# Altium schematic sheet FE_Channel.SchDoc: ThunderScope 1000E
size A3; DrawnBy: Aleksa Bjelogrlic; Revision: 1
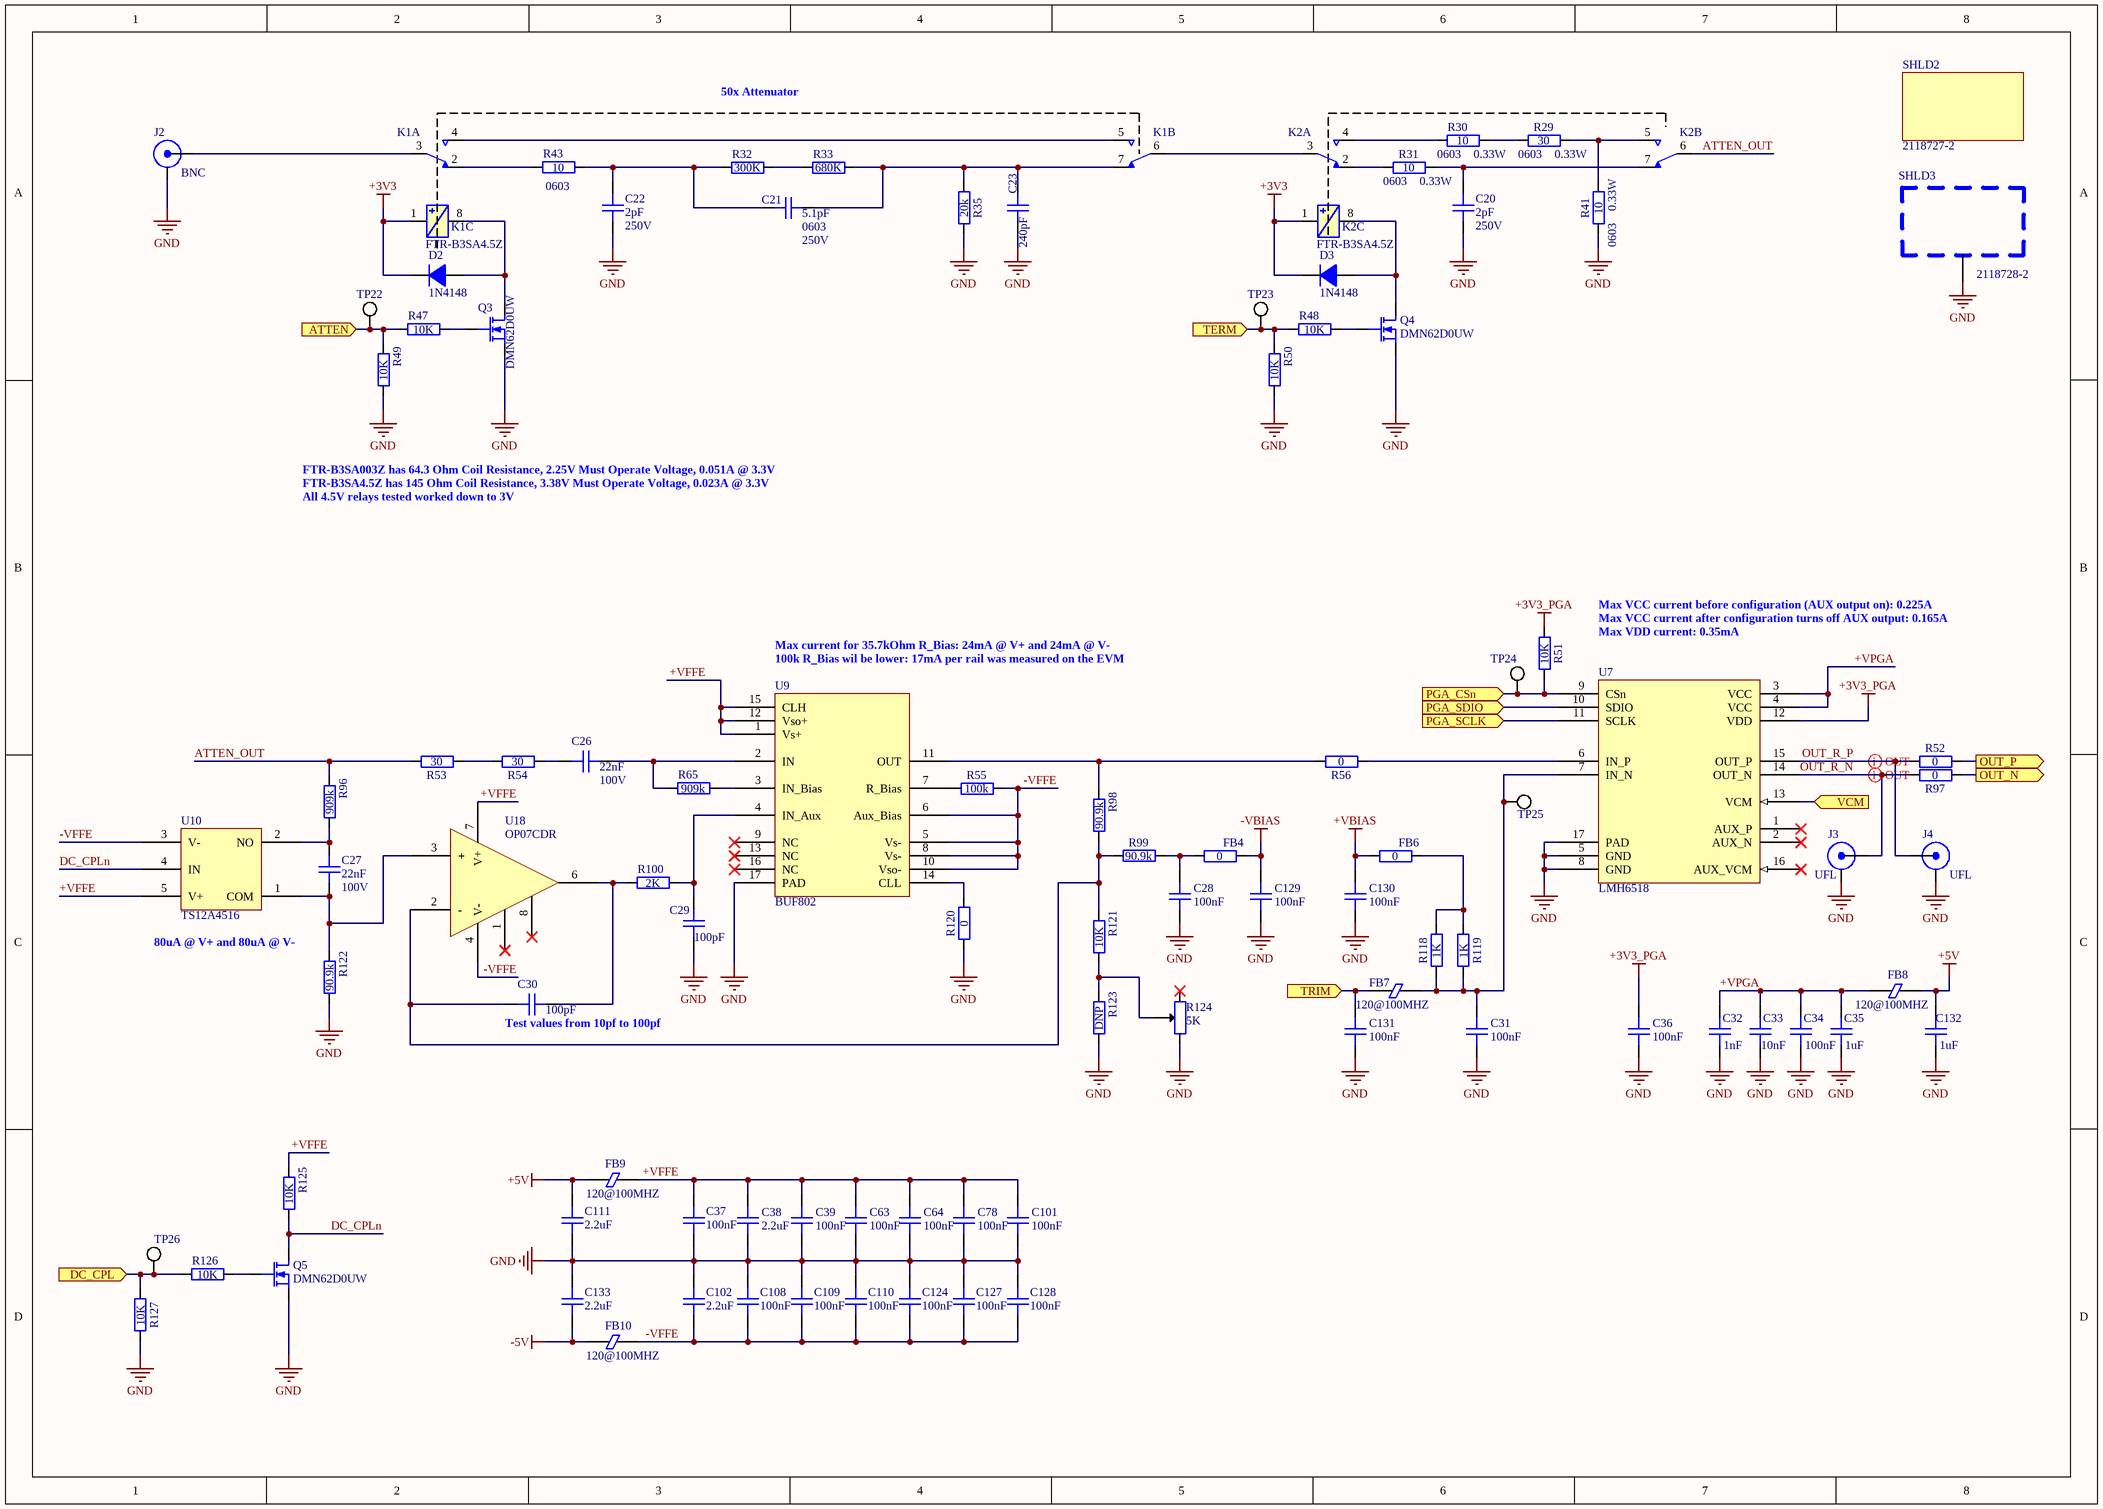
[diagram p0: FE_Channel.SchDoc]

## Parts
C20  2pF  Voltage Rating: 250V  [GEN_C_0603]
C21  5.1pF  Package: 0603  Voltage Rating: 250V  [GEN_C_0603]
C22  2pF  Voltage Rating: 250V  [GEN_C_0603]
C23  240pF  [GEN_C_0805]
C26  22nF  Voltage Rating: 100V  [GEN_C_0603]
C27  22nF  Voltage Rating: 100V  [GEN_C_0603]
C28  100nF  [GEN_C_0402]
C29  100pF  [GEN_C_0402]
C30  100pF  [GEN_C_0402]
C31  100nF  [GEN_C_0402]
C32  1nF  [GEN_C_0402]
C33  10nF  [GEN_C_0402]
C34  100nF  [GEN_C_0402]
C35  1uF  [GEN_C_0402]
C36  100nF  [GEN_C_0402]
C37  100nF  [GEN_C_0402]
C38  2.2uF  [GEN_C_0402]
C39  100nF  [GEN_C_0402]
C63  100nF  [GEN_C_0402]
C64  100nF  [GEN_C_0402]
C78  100nF  [GEN_C_0402]
C101  100nF  [GEN_C_0402]
C102  2.2uF  [GEN_C_0402]
C108  100nF  [GEN_C_0402]
C109  100nF  [GEN_C_0402]
C110  100nF  [GEN_C_0402]
C111  2.2uF  [GEN_C_0402]
C124  100nF  [GEN_C_0402]
C127  100nF  [GEN_C_0402]
C128  100nF  [GEN_C_0402]
C129  100nF  [GEN_C_0402]
C130  100nF  [GEN_C_0402]
C131  100nF  [GEN_C_0402]
C132  1uF  [GEN_C_0402]
C133  2.2uF  [GEN_C_0402]
D2  1N4148  [GEN_SOD_323]
D3  1N4148  [GEN_SOD_323]
FB4  0  [GEN_R_0402]
FB6  0  [GEN_R_0402]
FB7  120@100MHZ  [GEN_R_0402]
FB8  120@100MHZ  [GEN_R_0402]
FB9  120@100MHZ  [GEN_R_0402]
FB10  120@100MHZ  [GEN_R_0402]
J2  BNC  [MOL_0731000105]
J3  UFL  [TE_2334884-1]
J4  UFL  [TE_2334884-1]
K1  FTR-B3SA4.5Z  [FUJ_FTR-B3SA]  (value not drawn)  (parts A,B,C of 3)
K2  FTR-B3SA4.5Z  [FUJ_FTR-B3SA]  (value not drawn)  (parts A,B,C of 3)
Q3  DMN62D0UW  [GEN_SOT_323]
Q4  DMN62D0UW  [GEN_SOT_323]
Q5  DMN62D0UW  [GEN_SOT_323]
R29  30  Power Rating: 0.33W  Package: 0603  [GEN_R_0603]
R30  10  Package: 0603  Power Rating: 0.33W  [GEN_R_0603]
R31  10  Package: 0603  Power Rating: 0.33W  [GEN_R_0603]
R32  300K  [GEN_R_0402]
R33  680K  [GEN_R_0402]
R35  20k  [GEN_R_0402]
R41  10  Power Rating: 0.33W  Package: 0603  [GEN_R_0603]
R43  10  Package: 0603  [GEN_R_0603]
R47  10K  [GEN_R_0402]
R48  10K  [GEN_R_0402]
R49  10K  [GEN_R_0402]
R50  10K  [GEN_R_0402]
R51  10K  [GEN_R_0402]
R52  0  [GEN_R_0402]
R53  30  [GEN_R_0603]
R54  30  [GEN_R_0603]
R55  100k  [GEN_R_0402]
R56  0  [GEN_R_0402]
R65  909k  [GEN_R_0402]
R96  909k  [GEN_R_0402]
R97  0  [GEN_R_0402]
R98  90.9k  [GEN_R_0402]
R99  90.9k  [GEN_R_0402]
R100  2K  [GEN_R_0402]
R118  1K  [GEN_R_0402]
R119  1K  [GEN_R_0402]
R120  0  [GEN_R_0402]
R121  10K  [GEN_R_0402]
R122  90.9k  [GEN_R_0402]
R123  DNP  [GEN_R_0402]  (no BOM)
R124  5K  [BOU_3mm_POT]
R125  10K  [GEN_R_0402]
R126  10K  [GEN_R_0402]
R127  10K  [GEN_R_0402]
SHLD2  2118727-2  (mechanical)
SHLD3  2118728-2  [TE_2118728-2]
TP22  PCB  [GEN_TP_PCB]  (value not drawn)  (no BOM)
TP23  PCB  [GEN_TP_PCB]  (value not drawn)  (no BOM)
TP24  PCB  [GEN_TP_PCB]  (value not drawn)  (no BOM)
TP25  PCB  [GEN_TP_PCB]  (value not drawn)  (no BOM)
TP26  PCB  [GEN_TP_PCB]  (value not drawn)  (no BOM)
U7  LMH6518  [TI_WQFN_RGH0016A]
U9  BUF802  [TI_VQFN_RGT0016C]
U10  TS12A4516  [GEN_SOT23_5_950_2900X1600X1450]
U18  OP07CDR  [TI_SOIC8_D0008A]

## Ports
ATTEN (in), DC_CPL (in), OUT_N (out), OUT_P (out), PGA_CSn (in), PGA_SCLK (in), PGA_SDIO (in), TERM (in), TRIM (in), VCM (in)

## Nets
+3V3: D2.1(K) D3.1(K) K1.1 K2.1
+3V3_PGA: C36.2 R51.2 U7.12(VDD)
+5V: C111.2 C132.2 FB8.2 FB9.1
+VBIAS: C130.1 FB6.1
-5V: C133.1 FB10.1
-VBIAS: C129.1 FB4.2
GND: C20.2 C22.1 C23.1 C28.2 C29.1 C31.2 C32.1 C33.1 C34.1 C35.1 C36.1 C37.1 C38.2 C39.2 C63.2 C64.1 C78.1 C101.1 C102.1 C108.1 C109.2 C110.2 C111.1 C124.2 C127.1 C128.1 C129.2 C130.2 C131.2 C132.1 C133.2 J2.2(SHIELD) J3.2(SHIELD) J4.2(SHIELD) Q3.3(S) Q4.3(S) Q5.3(S) R35.1 R41.1 R49.1 R50.1 R120.1 R122.1 R123.1 R124.3 R127.1 SHLD3.1 U7.5(GND) U7.8(GND) U7.17(PAD) U9.17(PAD)
+VFFE: C37.2 C38.1 C39.1 C63.1 C64.2 C78.2 C101.2 FB9.2 R125.2 U9.1(Vs+) U9.12(Vso+) U9.15(CLH) U10.5(V+) U18.7(V+)
+VPGA: C32.2 C33.2 C34.2 C35.2 FB8.1 U7.3(VCC) U7.4(VCC)
-VFFE: C102.2 C108.2 C109.1 C110.1 C124.1 C127.2 C128.2 FB10.2 R55.2 U9.5(Vs-) U9.6(Aux_Bias) U9.8(Vs-) U9.10(Vso-) U10.3(V-) U18.4(V-)
ATTEN: R47.2 R49.2 TP22.1 ; port ATTEN
ATTEN_OUT: K2.6 R53.1 R96.2
DC_CPL: R126.2 R127.2 TP26.1 ; port DC_CPL
DC_CPLn: Q5.1(D) R125.1 U10.4(IN)
OUT_N: R97.2 ; port OUT_N
OUT_P: R52.2 ; port OUT_P
OUT_R_N: J3.1(Signal) R97.1 U7.14(OUT_N)
OUT_R_P: J4.1(Signal) R52.1 U7.15(OUT_P)
PGA_CSn: R51.1 TP24.1 U7.9(CSn) ; port PGA_CSn
PGA_SCLK: U7.11(SCLK) ; port PGA_SCLK
PGA_SDIO: U7.10(SDIO) ; port PGA_SDIO
TERM: R48.2 R50.2 TP23.1 ; port TERM
TRIM: C131.1 FB7.1 ; port TRIM
VCM: U7.13(VCM) ; port VCM
NetC20_1: C20.1 K2.7 R31.2
NetC21_1: C21.1 C23.2 K1.7 R33.2 R35.2
NetC21_2: C21.2 C22.2 R32.1 R43.1
NetC26_1: C26.1 R65.2 U9.2(IN)
NetC26_2: C26.2 R54.2
NetC27_1: C27.1 R96.1 U10.2(NO)
NetC27_2: C27.2 R122.2 U10.1(COM) U18.3(+)
NetC28_1: C28.1 FB4.1 R99.1
NetC29_2: C29.2 R100.1 U9.4(IN_Aux)
NetC30_1: C30.1 R100.2 U18.6(OUT)
NetC30_2: C30.2 R98.1 R99.2 R121.2 U18.2(-)
NetC31_1: C31.1 FB7.2 R118.1 R119.2 TP25.1 U7.7(IN_N)
NetD2_2: D2.2(A) K1.8 Q3.1(D)
NetD3_2: D3.2(A) K2.8 Q4.1(D)
NetFB6_2: FB6.2 R118.2 R119.1
NetJ2_1: J2.1(Signal) K1.3
NetK1_2: K1.2 R43.2
NetK1_4: K1.4 K1.5
NetK1_6: K1.6 K2.3
NetK2_2: K2.2 R31.1
NetK2_4: K2.4 R30.1
NetK2_5: K2.5 R29.2 R41.2
NetQ3_2: Q3.2(G) R47.1
NetQ4_2: Q4.2(G) R48.1
NetQ5_2: Q5.2(G) R126.1
NetR29_1: R29.1 R30.2
NetR32_2: R32.2 R33.1
NetR53_2: R53.2 R54.1
NetR55_1: R55.1 U9.7(R_Bias)
NetR56_1: R56.1 R98.2 U9.11(OUT)
NetR56_2: R56.2 U7.6(IN_P)
NetR65_1: R65.1 U9.3(IN_Bias)
NetR120_2: R120.2 U9.14(CLL)
NetR121_1: R121.1 R123.2 R124.2

Not connected (* = marked no-connect by the designer): R124 1*; U7 1(AUX_P)* 2(AUX_N)* 16(AUX_VCM)*; U9 9(NC)* 13(NC)* 16(NC)*; U18 1(N1)* 8(N2)*

## Layout directives
differential pair; differential pair class 100Z_Diff_PGA: OUT_R_N, OUT_R_P

## Notes on the sheet
- 50x Attenuator
- FTR-B3SA003Z has 64.3 Ohm Coil Resistance, 2.25V Must Operate Voltage, 0.051A @ 3.3V
- FTR-B3SA4.5Z has 145 Ohm Coil Resistance, 3.38V Must Operate Voltage, 0.023A @ 3.3V
- All 4.5V relays tested worked down to 3V
- Max current for 35.7kOhm R_Bias: 24mA @ V+ and 24mA @ V-
- Max VCC current before configuration (AUX output on): 0.225A
- Max VCC current after configuration turns off AUX output: 0.165A
- Max VDD current: 0.35mA
- (near U9) 100k R_Bias wil be lower: 17mA per rail was measured on the EVM
- 80uA @ V+ and 80uA @ V-
- (near C30) Test values from 10pf to 100pf

## Library data of the parts
C20 C22 = CAP 2pF 250V C0G 0603: Manufacturer: KEMET; Manufacturer Part Number: CBR06C309BAGAC; Value: 2pF; Supplier 1: Mouser; Supplier Part Number 1: 80-CBR06C209BAG; Package: 0603
C21 = CAP 5.1pF 250V C0G 0603: Manufacturer: KEMET; Manufacturer Part Number: CBR06C519BAGAC; Supplier 1: Mouser; Supplier Part Number 1: 80-CBR06C519BAGAC; Value: 5.1pF
C23 = CAP 240pF 250V C0G 0805: Manufacturer: Kyocera AVX; Manufacturer Part Number: 600F241FT250XT; Voltage Rating: 250V; Temperature Coefficient: C0G; Package: 0805; Supplier 1: Digi-Key; Supplier Part Number 1: 1284-1897-1-ND; Value: 240pF
C26 C27 = CAP 22nF 100V X7R 0603: Package: 0603; Value: 22nF; Supplier 1: Digi-Key; Supplier Part Number 1: 490-4782-1-ND
C28 C31 C34 C36 C39 C63 C64 C78 C101 C108-C110 C124 C127-C131 = CAP 100nF 16V X7R 0402: Voltage Rating: 16V; Package: 0402; Supplier 1: Digi-Key; Supplier Part Number 1: 490-4759-1-ND; Value: 100nF
C29 C30 = CAP 100pF 50V C0G 0402: Temperature Coefficient: C0G; Voltage Rating: 50V; Package: 0402; Value: 100pF; Supplier 1: Digi-Key; Supplier Part Number 1: 490-14349-1-ND
C32 = CAP 1nF 50V C0G 0402: Voltage Rating: 50V; Package: 0402; Supplier 1: Digi-Key; Supplier Part Number 1: 490-6189-1-ND; Value: 1nF
C33 = CAP 10nF 50V X7R 0402: Voltage Rating: 50V; Package: 0402; Supplier 1: Digi-Key; Supplier Part Number 1: 490-6351-1-ND; Value: 10nF
C35 C132 = CAP 1uF 25V X5R 0402: Voltage Rating: 25V; Package: 0402; Supplier 1: Digi-Key; Supplier Part Number 1: 490-10017-1-ND; Value: 1uF
C37 = CAP 100nF 16V X7R 0402: Manufacturer: Murata; House Part Number: C-100nF-0402-002; Manufacturer Part Number: GCM155R71C104KA55D; Voltage Rating: 16V; Package: 0402; Supplier 1: Digi-Key; Supplier Part Number 1: 490-4759-6-ND; Value: 100nF
C38 = CAP 2.2uF 10V X5R 0402: Manufacturer: Taiyo Yuden; Manufacturer Part Number: LMK105BJ225MV-F; Voltage Rating: 10V; Package: 0402; Supplier 1: Digi-Key; Supplier Part Number 1: 587-3153-1-ND; Value: 2.2uF
C102 C111 C133 = CAP 2.2uF 10V X5R 0402: Voltage Rating: 10V; Package: 0402; Supplier 1: Digi-Key; Supplier Part Number 1: 587-3153-1-ND; Value: 2.2uF
D2 D3 = DIODE 1N4148: Max Reverse Voltage: 75V; Max Current: 150mA; Supplier 1: Digi-Key; Supplier Part Number 1: 1N4148WS-FDICT-ND
FB4 FB6 R56 = RES 0 OHM 1/16W 0402: Manufacturer: Yageo; Manufacturer Part Number: RC0402JR-070RL; Supplier 1: Digi-Key; Supplier Part Number 1: 311-0.0JRCT-ND; Package: 0402; Value: 0
FB7-FB10 = FERRITE BEAD 120 OHM 0402: Supplier 1: Digi-Key; Supplier Part Number 1: 490-9656-1-ND
J2 = BNC JACK R/A: Supplier 1: Digi-Key; Supplier Part Number 1: WM5524-ND
J3 J4 = UFL Jack SMD: Supplier 1: Digi-Key; Supplier Part Number 1: A145155CT-ND
K1 K2 = RELAY DPDT-NO FTR-B3SA4.5Z: Manufacturer: Fujitsu; Supplier 1: Mouser; Supplier Part Number 1: 817-FTRB3SA4.5Z-B10; Manufacturer Part Number: FTR-B3SA4.5Z
Q3-Q5 = NMOS DMN62D0UW: Vdss: 60V; Id: 340mA; Max Power: 320mW; Supplier 1: Digi-Key; Supplier Part Number 1: DMN62D0UW-7DICT-ND
R29 = RES 30 OHM 1% 1/3W 0603: Tolerance: 1%; Value: 30; Supplier 1: Digi-Key; Supplier Part Number 1: 2019-SG73P1JTTD30R0FCT-ND
R30 R41 = RES 10 OHM 1% 1/3W 0603: Tolerance: 1%; Value: 10; Supplier 1: Digi-Key; Supplier Part Number 1: 2019-SG73P1JTTD10R0FCT-ND
R31 R43 = RES 10 OHM 1% 1/3W 0603: Manufacturer: KOA Speer; Manufacturer Part Number: SG73P1JTTD10R0F; Tolerance: 1%; Value: 10; Supplier 1: Digi-Key; Supplier Part Number 1: 2019-SG73P1JTTD10R0FCT-ND
R32 = RES 300K OHM 1% 1/10W 0402: Manufacturer: Panasonic; Manufacturer Part Number: ERJ-2RKF3003X; Tolerance: 1%; Package: 0402; Supplier 1: Digi-Key; Supplier Part Number 1: P300KLCT-ND; Value: 300K
R33 = RES 680K OHM 1% 1/16W 0402: Manufacturer: Yageo; Manufacturer Part Number: RC0402FR-07681KL; Tolerance: 1%; Package: 0402; Supplier 1: Digi-Key; Supplier Part Number 1: YAG3211CT-ND; Value: 680K
R35 = RES 20K OHM 1% 1/16W 0402: Manufacturer: Yageo; Manufacturer Part Number: RC0402FR-0720KL; Tolerance: 1%; Package: 0402; Supplier 1: Digi-Key; Supplier Part Number 1: 311-20.0KLRCT-ND; Value: 20k
R47-R51 R121 R126 = RES 10K OHM 1% 1/10W 0402: Tolerance: 1%; Power Rating: 0.1W; Package: 0402; Supplier 1: Digi-Key; Supplier Part Number 1: P10.0KLCT-ND; Value: 10K
R52 R97 R120 = RES 0 OHM 1/16W 0402: Power Rating: 0.0625W; Package: 0402; Supplier 1: Digi-Key; Supplier Part Number 1: 311-0.0JRCT-ND; Value: 0
R53 R54 = RES 30 OHM 1% 1/3W 0603: Manufacturer: KOA Speer; Manufacturer Part Number: SG73P1JTTD30R0F; Tolerance: 1%; Package: 0603; Value: 30; Supplier 1: Digi-Key; Supplier Part Number 1: 2019-SG73P1JTTD30R0FCT-ND
R55 = RES 100K OHM 1% 1/10W 0402: Tolerance: 1%; Power Rating: 0.1W; Package: 0402; Value: 100k; Supplier 1: Digi-Key; Supplier Part Number 1: 311-100KLRCT-ND
R65 R96 = RES 909K OHM 1% 1/16W 0402: Tolerance: 1%; Power Rating: 0.0625W; Package: 0402; Supplier 1: Digi-Key; Supplier Part Number 1: YAG2377CT-ND; Value: 909k
R98 R99 R122 = RES 90.9K OHM 1% 1/16W 0402: Tolerance: 1%; Power Rating: 0.0625W; Package: 0402; Supplier 1: Digi-Key; Supplier Part Number 1: 311-90.9KLRCT-ND; Value: 90.9k
R100 = RES 2K OHM 1% 1/16W 0402: Tolerance: 1%; Power Rating: 0.0625W; Package: 0402; Supplier 1: Digi-Key; Supplier Part Number 1: 311-2KLRCT-ND; Value: 2K
R118 R119 = RES 1K OHM 1% 1/10W 0402: Tolerance: 1%; Power Rating: 0.1W; Package: 0402; Supplier 1: Digi-Key; Supplier Part Number 1: 311-1.00KLRCT-ND; Value: 1K
R123 = RES DNP 0402: Tolerance: 1%; Power Rating: 0.0625W; Package: 0402; Value: DNP
R124 = TRIMMER 5K OHM 0.1W J LEAD TOP: Tolerance: 1%; Power Rating: 0.1W; Supplier 1: Digi-Key; Supplier Part Number 1: TC33X-502ECT-ND; Value: 5K
R125 R127 = RES 10K OHM 1% 1/10W 0402: Manufacturer: Panasonic; Manufacturer Part Number: ERJ-2RKF1002X; Tolerance: 1%; Package: 0402; Supplier 1: Digi-Key; Supplier Part Number 1: P10.0KLCT-ND; Value: 10K
SHLD2 = SHIELD 2118727-2: Supplier 1: Digi-Key; Supplier Part Number 1: A126132-ND
SHLD3 = SHIELD 2118728-2: Supplier 1: Digi-Key; Supplier Part Number 1: A126158CT-ND
TP22-TP26 = TP PCB 1mm
U7 = IC PGA LMH6518: Supplier 1: Digi-Key; Supplier Part Number 1: LMH6518SQE/NOPBCT-ND
U9 = IC BUFFER AMP BUF802: Supplier 1: Mouser; Supplier Part Number 1: 595-BUF802IRGTR
U10 = IC SWITCH SPST TS12A4516DBVR: Manufacturer: Texas Instruments; Supplier 1: Digi-Key; Supplier Part Number 1: 296-24269-1-ND; Manufacturer Part Number: TS12A4516DBVR
U18 = IC OPAMP OP07CDR: Supplier 1: Digi-Key; Supplier Part Number 1: 296-14626-1-ND